# EAGLE design radio103 (EAGLE 9.6.2)

## Sheet 1 of 4: cpu
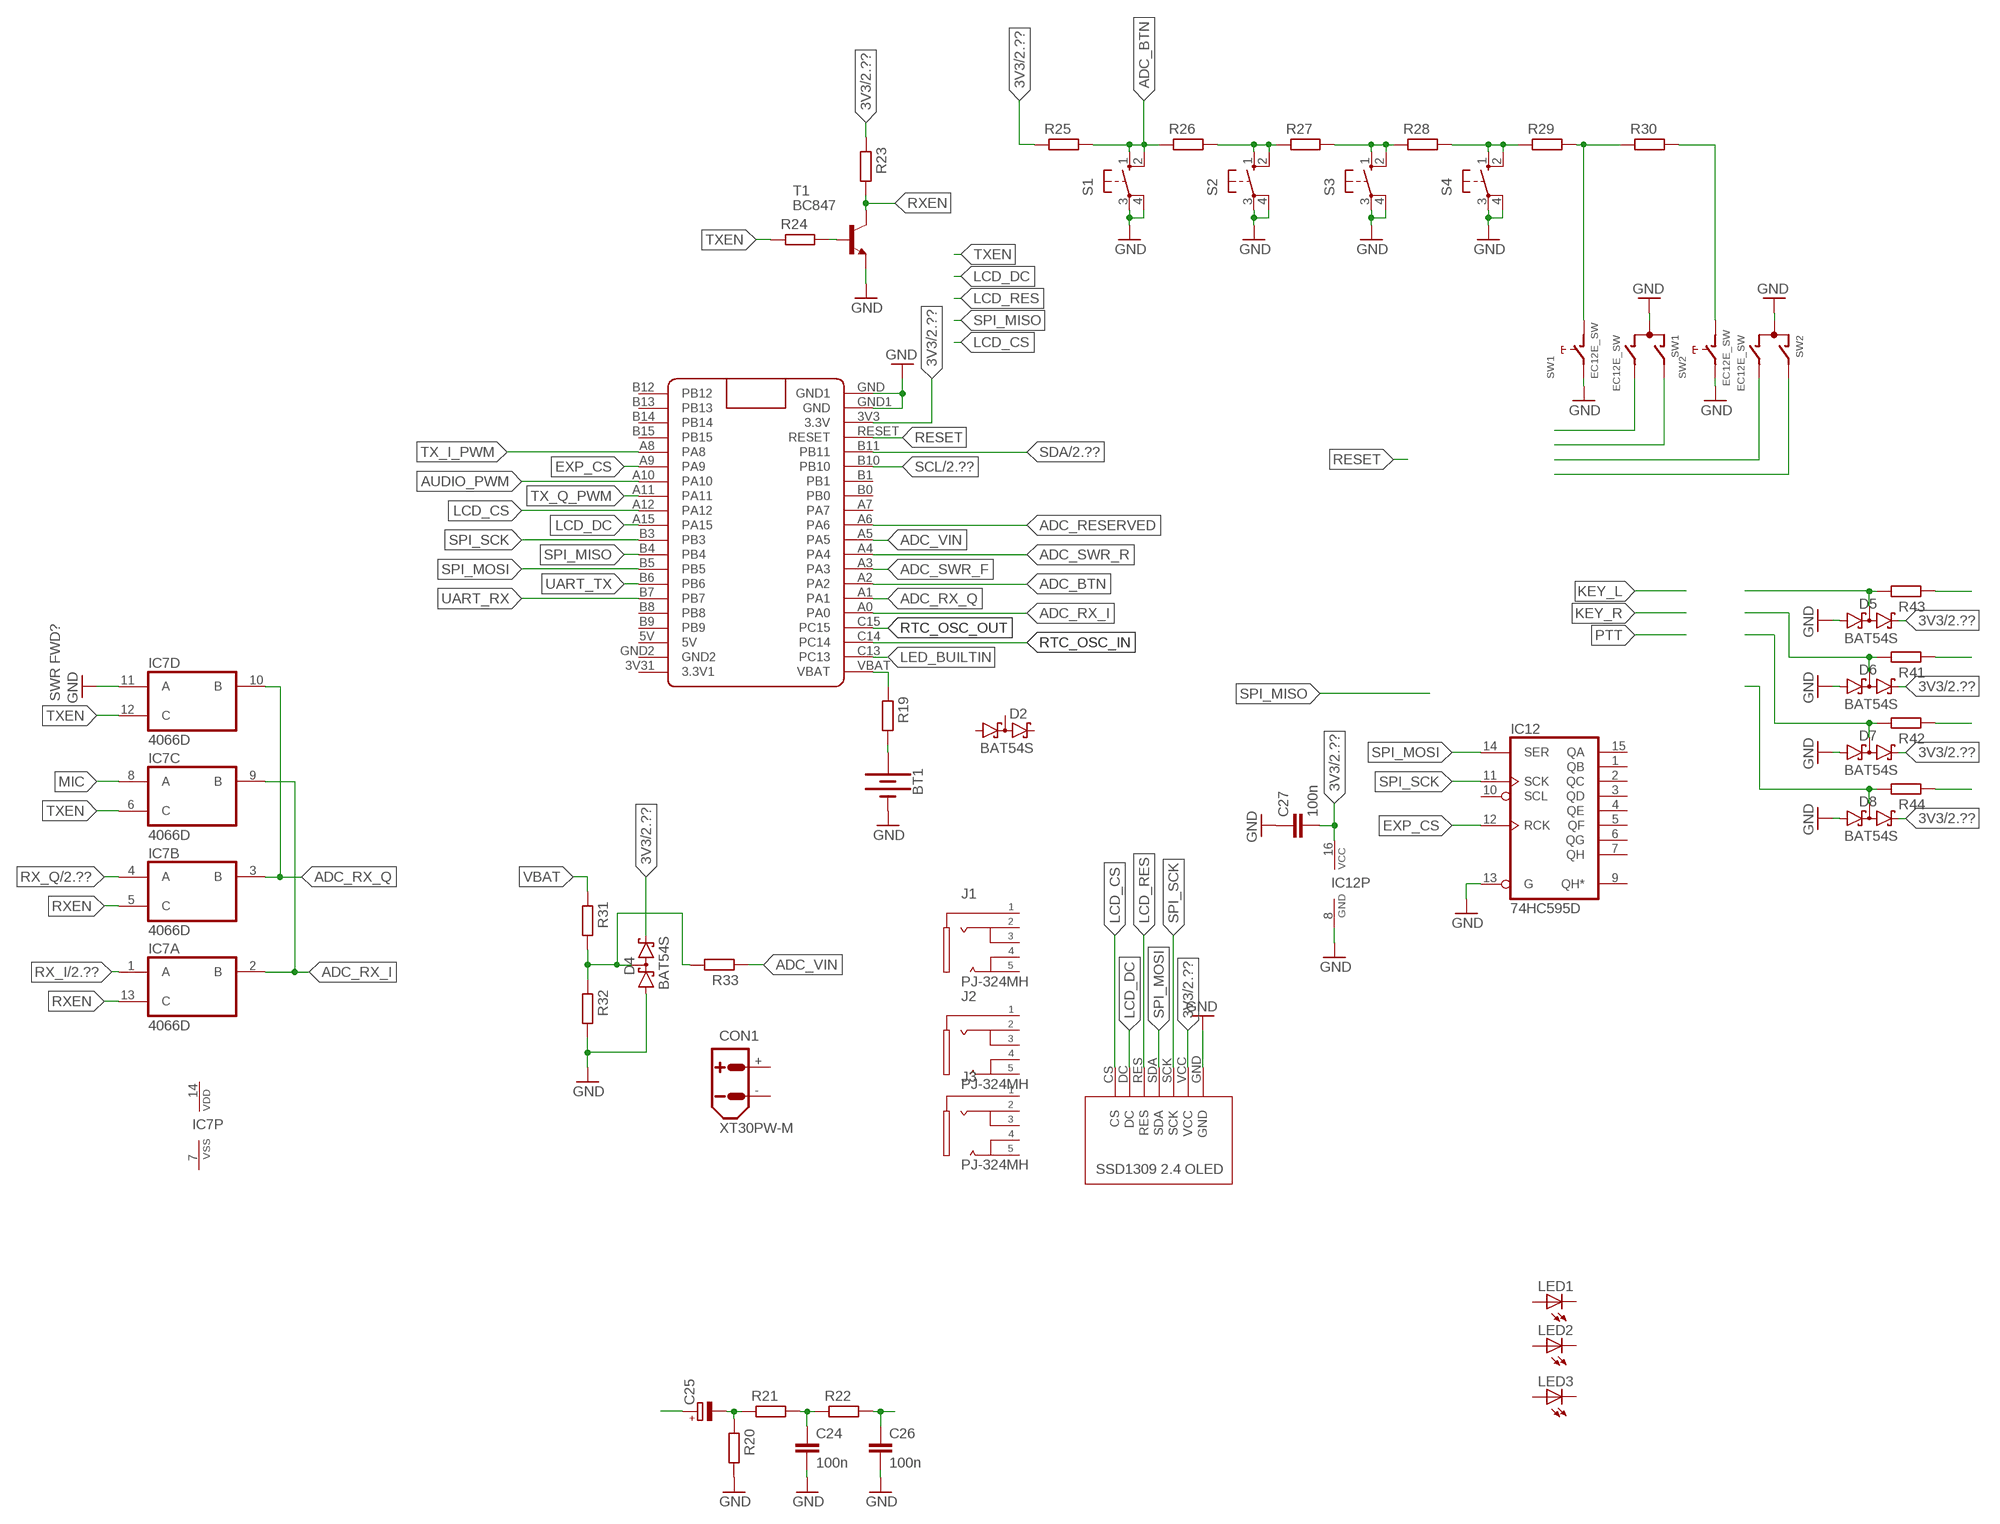
[diagram p0: schematic, sheet 1]

### Parts
BT1  BATTERY-12MM_SMD  [BATTCON_12MM]
C24  100n  C-EUC0805K  [C0805K]
C25  CPOL-EUE2,5-6E  [E2,5-6E]
C26  100n  C-EUC0805K  [C0805K]
C27  100n  C-EUC0805K  [C0805K]
CON1  XT30PW-M  [XT30PW-M]
D2  BAT54S  [SOT23]
D4  BAT54S  [SOT23]
D5  BAT54S  [SOT23]
D6  BAT54S  [SOT23]
D7  BAT54S  [SOT23]
D8  BAT54S  [SOT23]
IC7  4066D  [SO14]
IC12  74HC595D  [SO16]
J1  PJ-324MH  [PJ-324MH]
J2  PJ-324MH  [PJ-324MH]
J3  PJ-324MH  [PJ-324MH]
LED1  OSYG1608  [C1608]
LED2  OSYG1608  [C1608]
LED3  OSYG1608  [C1608]
R19  R-EU_R0805  [R0805]
R20  R-EU_R0805  [R0805]
R21  R-EU_R0805  [R0805]
R22  R-EU_R0805  [R0805]
R23  R-EU_R0805  [R0805]
R24  R-EU_R0805  [R0805]
R25  R-EU_R0805  [R0805]
R26  R-EU_R0805  [R0805]
R27  R-EU_R0805  [R0805]
R28  R-EU_R0805  [R0805]
R29  R-EU_R0805  [R0805]
R30  R-EU_R0805  [R0805]
R31  R-EU_R0805  [R0805]
R32  R-EU_R0805  [R0805]
R33  R-EU_R0805  [R0805]
R41  R-EU_R0805  [R0805]
R42  R-EU_R0805  [R0805]
R43  R-EU_R0805  [R0805]
R44  R-EU_R0805  [R0805]
S1  10-XX  [B3F-10XX]
S2  10-XX  [B3F-10XX]
S3  10-XX  [B3F-10XX]
S4  10-XX  [B3F-10XX]
SW1  EC12E_SW  [ALPS_EC12E_SW]
SW2  EC12E_SW  [ALPS_EC12E_SW]
T1  BC847  [SOT23]
U$1  BLUE_PILL  [BLUE_PILL]
U$4  SSD1309_2.4_OLED  [SSD1309_2.42_OLED]

### Nets
3V3: C27.2 D4.2(C2) D5.2(C2) D6.2(C2) D7.2(C2) D8.2(C2) IC12.16(VCC) R23.2 R25.2 U$1.3V3(3.3V) U$4.VCC ; also sheet 2,3
ADC_BTN: R25.1 R26.2 S1.1(S) S1.2(S1) U$1.A2
ADC_RESERVED: U$1.A6
ADC_RX_I: IC7.2(A:B) IC7.9(C:B) U$1.A0
ADC_RX_Q: IC7.3(B:B) IC7.10(D:B) U$1.A1
ADC_SWR_F: U$1.A3
ADC_SWR_R: U$1.A4
ADC_VIN: R33.2 U$1.A5
AUDIO_PWM: U$1.A10
EXP_CS: IC12.12(RCK) U$1.A9
GND: BT1.GND(-) C24.2 C26.2 C27.1 D4.1(A1) D5.1(A1) D6.1(A1) D7.1(A1) D8.1(A1) IC7.11(D:A) IC12.8(GND) IC12.13(G) R20.1 R32.1 S1.3(P) S1.4(P1) S2.3(P) S2.4(P1) S3.3(P) S3.4(P1) S4.3(P) S4.4(P1) SW1.C SW1.E SW2.C SW2.E T1.2(E) U$1.GND1(GND) U$1.GND(GND1) U$4.GND ; also sheet 2,3,4
LCD_CS: U$1.A12 U$4.CS
LCD_DC: U$1.A15 U$4.DC
LCD_RES: U$4.RES
LED_BUILTIN: U$1.C13
MIC: IC7.8(C:A)
N$16: SW1.B
N$32: C25.- R20.2 R21.2
N$33: C24.1 R21.1 R22.2
N$34: C26.1 R22.1
N$35: C25.+
N$36: BT1.PWR@1(+) R19.1
N$37: R19.2 U$1.VBAT
N$38: SW1.A
N$39: R24.1 T1.1(B)
N$40: SW2.B
N$41: SW2.A
N$42: R26.1 R27.2 S2.1(S) S2.2(S1)
N$43: D4.3(C1A2) R31.1 R32.2 R33.1
N$44: R27.1 R28.2 S3.1(S) S3.2(S1)
N$45: R28.1 R29.2 S4.1(S) S4.2(S1)
N$46: R29.1 R30.2 SW1.D
N$47: R30.1 SW2.D
N$55: D5.3(C1A2) R43.1
N$56: R43.2
N$57: D6.3(C1A2) R41.1
N$58: R41.2
N$59: D7.3(C1A2) R42.1
N$60: R42.2
N$61: D8.3(C1A2) R44.1
N$62: R44.2
RESET: U$1.RESET
RTC_OSC_IN: U$1.C14
RTC_OSC_OUT: U$1.C15
RX_I: IC7.1(A:A) ; also sheet 2
RX_Q: IC7.4(B:A) ; also sheet 2
RXEN: IC7.5(B:C) IC7.13(A:C) R23.1 T1.3(C)
SCL: U$1.B10 ; also sheet 2
SDA: U$1.B11 ; also sheet 2
SPI_MISO: U$1.B4
SPI_MOSI: IC12.14(SER) U$1.B5 U$4.SDA
SPI_SCK: IC12.11(SCK) U$1.B3 U$4.SCK
TX_I_PWM: U$1.A8
TX_Q_PWM: U$1.A11
TXEN: IC7.6(C:C) IC7.12(D:C) R24.2
UART_RX: U$1.B7
UART_TX: U$1.B6
VBAT: R31.2
Unconnected: D2.1(A1) D2.2(C2) D2.3(C1A2) IC12.1(QB) IC12.2(QC) IC12.3(QD) IC12.4(QE) IC12.5(QF) IC12.6(QG) IC12.7(QH) IC12.9(QH*) IC12.10(SCL) IC12.15(QA) J1.1 J1.2 J1.3 J1.4 J1.5 J2.1 J2.2 J2.3 J2.4 J2.5 J3.1 J3.2 J3.3 J3.4 J3.5 LED1.A LED1.C LED2.A LED2.C LED3.A LED3.C SW1.GND1(G) SW1.GND2(G) SW2.GND1(G) SW2.GND2(G) U$1.3V31(3.3V1) U$1.5V U$1.A7 U$1.B0 U$1.B1 U$1.B8 U$1.B9 U$1.B12 U$1.B13 U$1.B14 U$1.B15 U$1.GND2

### Notes on the sheet
- SWR FWD?

## Sheet 2 of 4: mixer
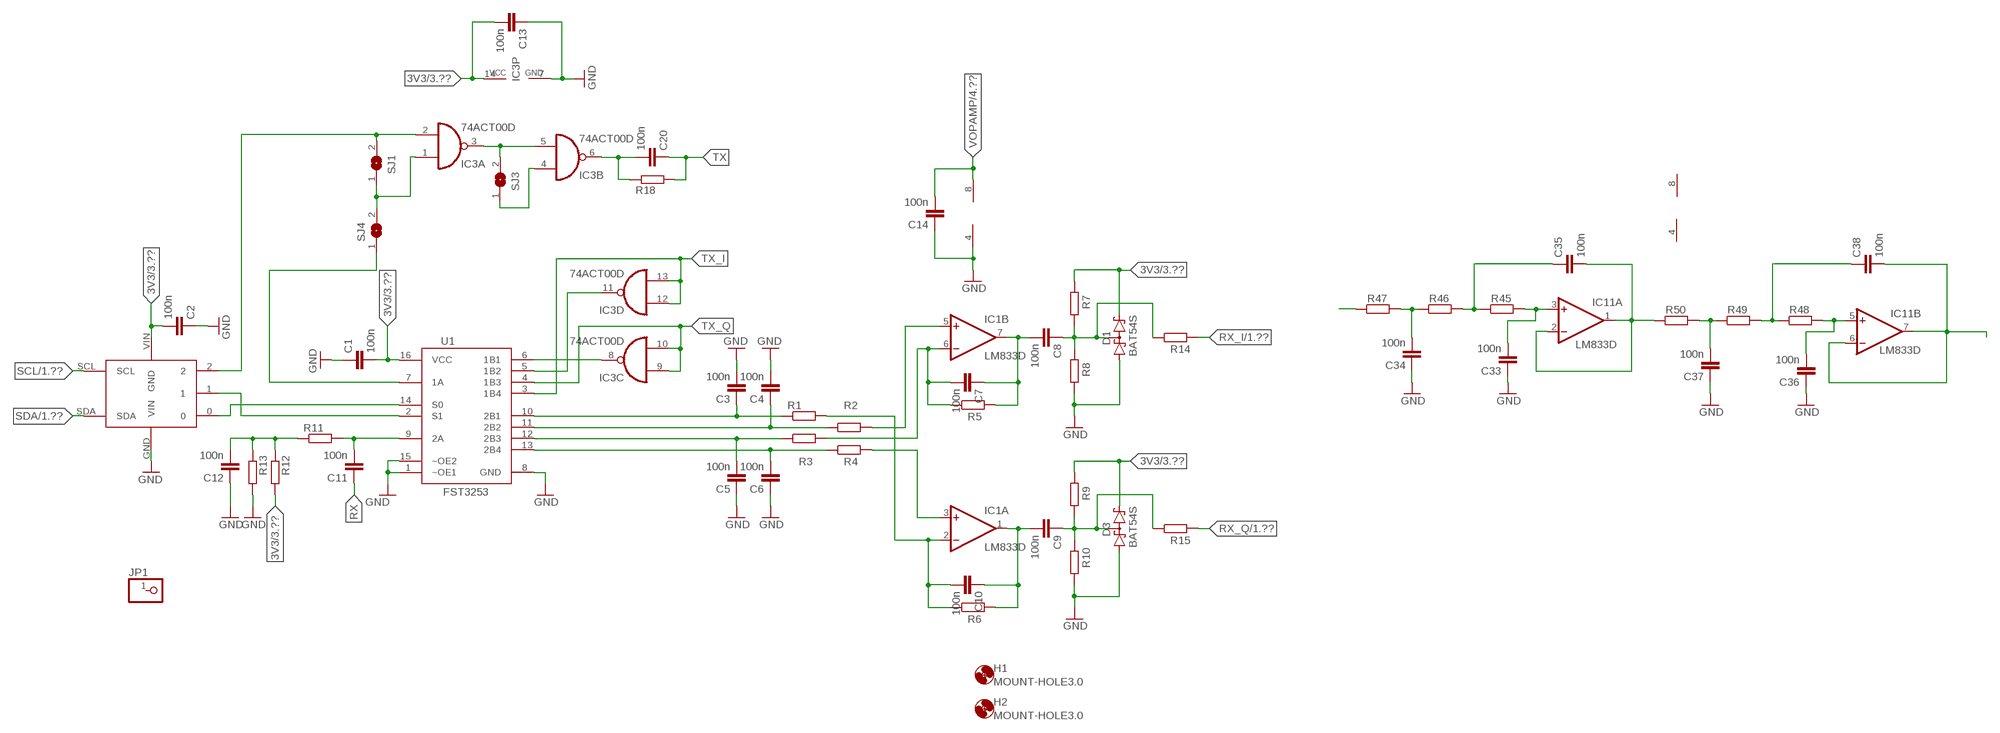
[diagram p1: schematic, sheet 2]

### Parts
C1  100n  C-EUC0805K  [C0805K]
C2  100n  C-EUC0805K  [C0805K]
C3  100n  C-EUC0805K  [C0805K]
C4  100n  C-EUC0805K  [C0805K]
C5  100n  C-EUC0805K  [C0805K]
C6  100n  C-EUC0805K  [C0805K]
C7  100n  C-EUC0805K  [C0805K]
C8  100n  C-EUC0805K  [C0805K]
C9  100n  C-EUC0805K  [C0805K]
C10  100n  C-EUC0805K  [C0805K]
C11  100n  C-EUC0805K  [C0805K]
C12  100n  C-EUC0805K  [C0805K]
C13  100n  C-EUC0805K  [C0805K]
C14  100n  C-EUC0805K  [C0805K]
C20  100n  C-EUC0805K  [C0805K]
C33  100n  C-EUC0805K  [C0805K]
C34  100n  C-EUC0805K  [C0805K]
C35  100n  C-EUC0805K  [C0805K]
C36  100n  C-EUC0805K  [C0805K]
C37  100n  C-EUC0805K  [C0805K]
C38  100n  C-EUC0805K  [C0805K]
D1  BAT54S  [SOT23]
D3  BAT54S  [SOT23]
H1  MOUNT-HOLE3.0  [3,0]
H2  MOUNT-HOLE3.0  [3,0]
IC1  LM833D  [SO08]
IC3  74ACT00D  [SO14]
IC11  LM833D  [SO08]
JP1  PINHD-1X1  [1X01]
R1  R-EU_R0805  [R0805]
R2  R-EU_R0805  [R0805]
R3  R-EU_R0805  [R0805]
R4  R-EU_R0805  [R0805]
R5  R-EU_R0805  [R0805]
R6  R-EU_R0805  [R0805]
R7  R-EU_R0805  [R0805]
R8  R-EU_R0805  [R0805]
R9  R-EU_R0805  [R0805]
R10  R-EU_R0805  [R0805]
R11  R-EU_R0805  [R0805]
R12  R-EU_R0805  [R0805]
R13  R-EU_R0805  [R0805]
R14  R-EU_R0805  [R0805]
R15  R-EU_R0805  [R0805]
R18  R-EU_R0805  [R0805]
R45  R-EU_R0805  [R0805]
R46  R-EU_R0805  [R0805]
R47  R-EU_R0805  [R0805]
R48  R-EU_R0805  [R0805]
R49  R-EU_R0805  [R0805]
R50  R-EU_R0805  [R0805]
SJ1  SJ  [SJ]
SJ3  SJ  [SJ]
SJ4  SJ  [SJ]
U1  FST3253  [TSSOP16L]
U$2  CJMCU-5351  [CJMCU-5351]

### Nets
3V3: C1.2 C2.2 C13.2 D1.2(C2) D3.2(C2) IC3.14(P:VCC) R7.2 R9.2 R12.2 U1.16(VCC) U$2.VIN(GND) ; also sheet 1,3
ADC_I1: C8.1 D1.3(C1A2) R7.1 R8.2 R14.1
ADC_Q1: C9.1 D3.3(C1A2) R9.1 R10.2 R15.1
GND: C1.1 C2.1 C3.2 C4.2 C5.1 C6.1 C12.1 C13.1 C14.1 C33.1 C34.1 C36.1 C37.1 D1.1(A1) D3.1(A1) IC1.4(P:V-) IC3.7(P:GND) R8.1 R10.1 R13.2 U1.1(~OE1) U1.8(GND) U1.15(~OE2) U$2.GND(VIN) ; also sheet 1,3,4
N$1: C3.1 R1.1 U1.10(2B1)
N$2: C4.1 R2.1 U1.11(2B2)
N$3: C5.2 R3.1 U1.12(2B3)
N$4: C6.2 R4.1 U1.13(2B4)
N$5: C10.2 IC1.2(A:-IN) R1.2 R6.1
N$6: IC1.5(B:+IN) R2.2
N$7: C7.2 IC1.6(B:-IN) R3.2 R5.1
N$8: IC1.3(A:+IN) R4.2
N$9: C9.2 C10.1 IC1.1(A:OUT) R6.2
N$10: C7.1 C8.2 IC1.7(B:OUT) R5.2
N$12: C11.2 R11.2 U1.9(2A)
N$13: U1.2(S1) U$2.1
N$14: C12.2 R11.1 R12.1 R13.1
N$15: U1.14(S0) U$2.0
N$17: IC3.8(C:O) U1.6(1B1)
N$18: IC3.11(D:O) U1.5(1B2)
N$26: IC3.2(A:I1) SJ1.2 U$2.2
N$27: IC3.1(A:I0) SJ1.1 SJ4.2
N$28: IC3.3(A:O) IC3.5(B:I1) SJ3.2
N$29: IC3.4(B:I0) SJ3.1
N$30: C20.2 IC3.6(B:O) R18.1
N$31: SJ4.1 U1.7(1A)
N$63: C33.2 IC11.3(A:+IN) R45.2
N$64: C35.1 R45.1 R46.2
N$65: C35.2 IC11.1(A:OUT) IC11.2(A:-IN) R50.1
N$66: C38.1 R48.1 R49.2
N$67: C34.2 R46.1 R47.2
N$68: R47.1
N$69: C37.2 R49.1 R50.2
N$71: C36.2 IC11.5(B:+IN) R48.2
N$73: C38.2 IC11.6(B:-IN) IC11.7(B:OUT)
RX: C11.1
RX_I: R14.2 ; also sheet 1
RX_Q: R15.2 ; also sheet 1
SCL: U$2.SCL ; also sheet 1
SDA: U$2.SDA ; also sheet 1
TX: C20.1 R18.2
TX_I: IC3.12(D:I0) IC3.13(D:I1) U1.3(1B4)
TX_Q: IC3.9(C:I0) IC3.10(C:I1) U1.4(1B3)
VOPAMP: C14.2 IC1.8(P:V+) ; also sheet 4
Unconnected: JP1.1

## Sheet 3 of 4: power
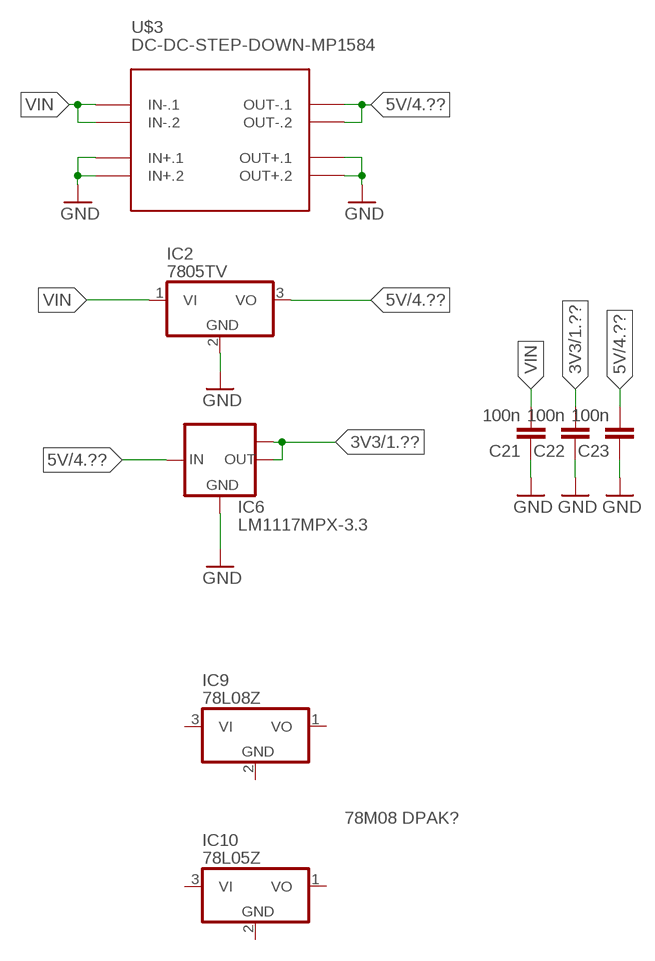
[diagram p2: schematic, sheet 3]

### Parts
C21  100n  C-EUC0805K  [C0805K]
C22  100n  C-EUC0805K  [C0805K]
C23  100n  C-EUC0805K  [C0805K]
IC2  7805TV  [TO220V]
IC6  LM1117MPX-3.3  [SOT223]
IC9  78L08Z  [TO92]
IC10  78L05Z  [TO92]
U$3  DC-DC-STEP-DOWN-MP1584  [DC-DC-STEP-DOWN-MP1584]

### Nets
3V3: C22.2 IC6.2(OUT) IC6.TAB(OUT1) ; also sheet 1,2
5V: C23.2 IC2.3(VO) IC6.3(IN) U$3.OUT-.1 U$3.OUT-.2 ; also sheet 4
GND: C21.1 C22.1 C23.1 IC2.2(GND) IC6.1(GND) U$3.IN+.1 U$3.IN+.2 U$3.OUT+.1 U$3.OUT+.2 ; also sheet 1,2,4
VIN: C21.2 IC2.1(VI) U$3.IN-.1 U$3.IN-.2
Unconnected: IC9.1(VO) IC9.2(GND) IC9.3(VI) IC10.1(VO) IC10.2(GND) IC10.3(VI)

### Notes on the sheet
- 78M08 DPAK?

## Sheet 4 of 4: audio
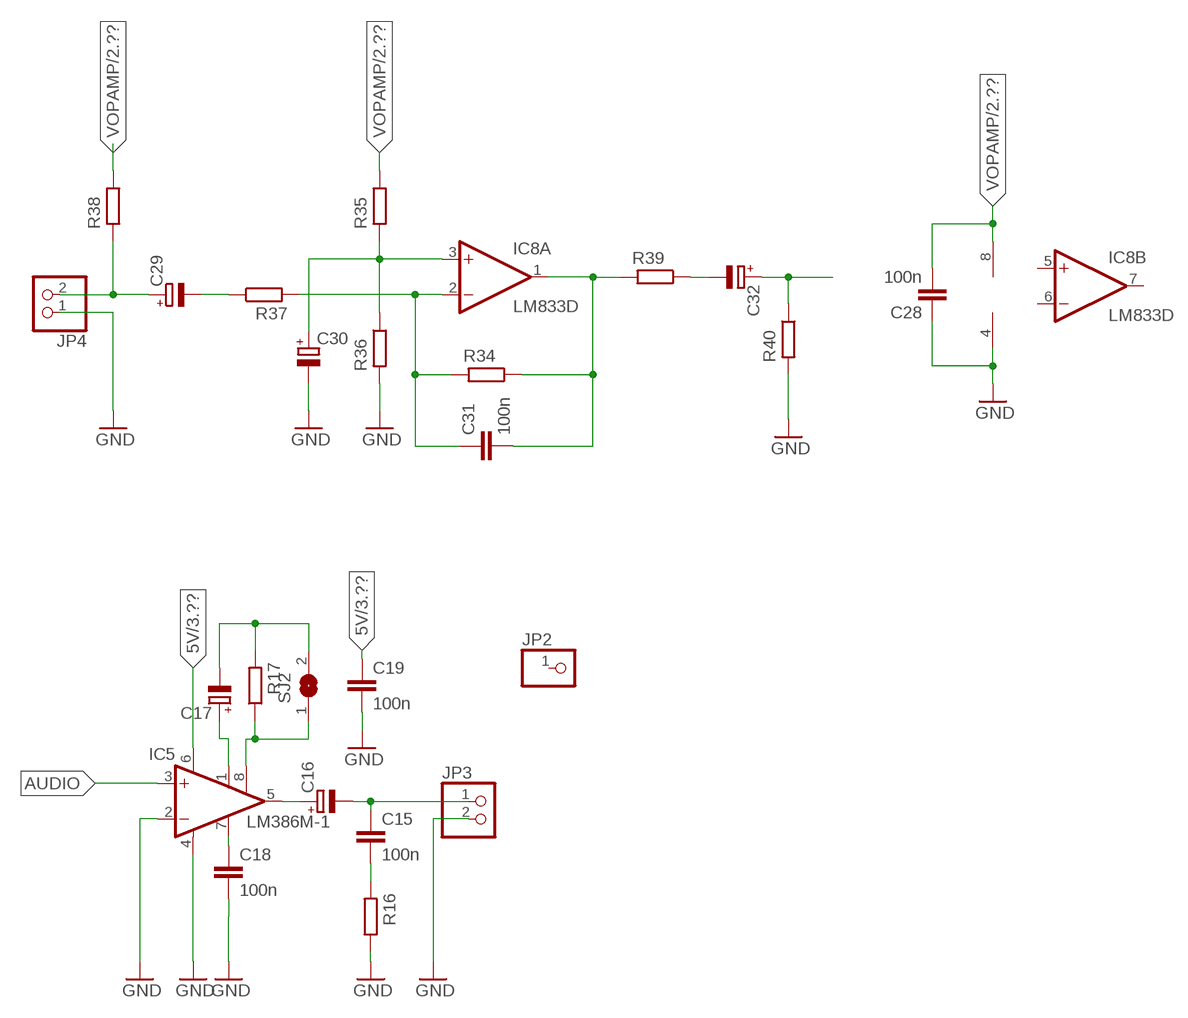
[diagram p3: schematic, sheet 4]

### Parts
C15  100n  C-EUC0805K  [C0805K]
C16  CPOL-EUE2,5-6E  [E2,5-6E]
C17  CPOL-EUE2,5-6E  [E2,5-6E]
C18  100n  C-EUC0805K  [C0805K]
C19  100n  C-EUC0805K  [C0805K]
C28  100n  C-EUC0805K  [C0805K]
C29  CPOL-EUE2,5-6E  [E2,5-6E]
C30  CPOL-EUE2,5-6E  [E2,5-6E]
C31  100n  C-EUC0805K  [C0805K]
C32  CPOL-EUE2,5-6E  [E2,5-6E]
IC5  LM386M-1  [SO08]
IC8  LM833D  [SO08]
JP2  PINHD-1X1  [1X01]
JP3  PINHD-1X2  [1X02]
JP4  PINHD-1X2  [1X02]
R16  R-EU_R0805  [R0805]
R17  R-EU_R0805  [R0805]
R34  R-EU_R0805  [R0805]
R35  R-EU_R0805  [R0805]
R36  R-EU_R0805  [R0805]
R37  R-EU_R0805  [R0805]
R38  R-EU_R0805  [R0805]
R39  R-EU_R0805  [R0805]
R40  R-EU_R0805  [R0805]
SJ2  SJ  [SJ]

### Nets
5V: C19.1 IC5.6(VS) ; also sheet 3
AUDIO: IC5.3(+IN)
GND: C18.2 C19.2 C28.1 C30.- IC5.2(-IN) IC5.4(GND) IC8.4(P:V-) JP3.2 JP4.1 R16.1 R36.2 R40.2 ; also sheet 1,2,3
N$19: C17.+ IC5.1(GAIN)
N$20: IC5.8(GAIN) R17.1 SJ2.1
N$21: C17.- R17.2 SJ2.2
N$22: C18.1 IC5.7(BYPASS)
N$23: C16.+ IC5.5(OUT)
N$24: C15.1 C16.- JP3.1
N$25: C15.2 R16.2
N$48: C30.+ IC8.3(A:+IN) R35.2 R36.1
N$49: C31.1 IC8.2(A:-IN) R34.2 R37.2
N$50: C31.2 IC8.1(A:OUT) R34.1 R39.2
N$51: C29.- R37.1
N$52: C29.+ JP4.2 R38.2
N$53: C32.- R39.1
N$54: C32.+ R40.1
VOPAMP: C28.2 IC8.8(P:V+) R35.1 R38.1 ; also sheet 2
Unconnected: IC8.5(B:+IN) IC8.6(B:-IN) IC8.7(B:OUT) JP2.1

## Power pins joined to a net without a drawn wire
+: CON1.+
-: CON1.-
V+: IC11.8(P:V+)
V-: IC11.4(P:V-)
VDD: IC7.14(P:VDD)
VSS: IC7.7(P:VSS)

## Library data of the parts
BT1 = SparkFun-Batteries:BATTERY: Battery - Single Cell A variety of battery chemistries, sizes, and footprints. Device List: 20MM_PTH - Coin Cell Battery Holder - 20mm (PTH) <https://www.sparkfun.com/products/783> 20MM_PTH_KIT- Coin Cell battery Holder - 20 mm (PTH) <http://www.sparkfun.com/products/783>kit version with special mask 6.8MM_PTH - Coin Cell Battery Holder - 6.8MM(SMD) <https://www.digikey.com/product-detail/en/seiko-instruments/MS621FE-FL11E/728-1057-ND/1889208?WT.srch=1&gclid=CNOQ5a6LzdQCFZS2wAodXCkE0g> 12MM_SMD - Coin Cell Battery Holder - 12mm (SMD) <https://www.sparkfun.com/products/10592> 12MM_PTH - Coin Cell Battery Holder - 12mm (PTH) <https://www.sparkfun.com/products/7948> 20MM_SMD - 20mm Coin Cell Battery Holder (SMD) (2 legs) Used on the Big Time Watch Kit <https://www.sparkfun.com/products/11734> 20MM_SMD_4LEGS - Coin Cell Battery Holder - 20mm (SMD) <https://www.sparkfun.com/products/11892> 20MM_SMD_4LEGS_OVERPASTE - Coin Cell Battery Holder - 20mm (SMD) <https://www.sparkfun.com/products/11892> (Over-paste on the legs) 24.5MM_PTH - Coin Cell Battery Holder - 24.5mm (PTH) <https://www.sparkfun.com/products/8863> 9V - 9V Battery Holder - PC Mount Used on the SparkFun SparkPunk Sound Kit <https://www.sparkfun.com/products/11177> and SparkFun SparkPunk Sequencer Kit <https://www.sparkfun.com/products/12707> 18650 - Battery Holder - 18650 (PTH) <https://www.sparkfun.com/products/13113> AA - Battery Holder - 1xAA (PTH) <https://www.sparkfun.com/products/7949> AAA - Battery Holder - 1xAAA (PTH) <https://www.sparkfun.com/products/12718> AA_KIT - Battery Holder - 1xAA (PTH) <https://www.sparkfun.com/products/7949> Special kit package - pads only have exposed copper on one side of the board. AAA_KIT - Battery Holder - 1xAAA (PTH) <https://www.sparkfun.com/products/12718> Special kit package - pads only have exposed copper on one side of the board.; PROD_ID: BATT-08044; SF_SKU: PRT-10592
C1-C15 C18-C24 C26-C28 C31 C33-C38 = rcl:C-EU: CAPACITOR, European symbol; SPICEPREFIX: C
C16 C17 C25 C29 C30 C32 = rcl:CPOL-EU: POLARIZED CAPACITOR, European symbol; SPICEPREFIX: C
CON1 = amass:XT30: AMASS XT30 connector Store in Japan AMASS XT30 connector <https://szc.jp/ams-xt30>
D1-D8 = diode:BAT54S: Schottky Diodes Pin connection corrected 2011-05-04 Source: Fairchild .. BAT54.pdf
H1 H2 = holes:MOUNT-HOLE: MOUNTING HOLE with drill center marker
IC1 IC8 IC11 = linear:LM833: OP AMP
IC2 IC9 IC10 = linear:78*: Positive VOLTAGE REGULATOR Source: http://cache.national.com/ds/LM/LM78L05.pdf http://www.fairchildsemi.com/ds/LM/LM7805.pdf
IC3 = 74xx-eu:74*00: Quad 2-input NAND gate
IC5 = linear:LM386?-*: Low Voltage Audio Power Amplifier Source: http://cache.national.com/ds/LM/LM386.pdf
IC6 = lm1117:LM1117MPX-*
IC7 = 40xx:4066: Quad bilateral ANALOG SWITCH
IC12 = 74xx-eu:74*595: 8-bit SHIFT REGISTER, output latch
J1-J3 = ub0baa:PJ-324M
JP1 JP2 = pinhead:PINHD-1X1: PIN HEADER
JP3 JP4 = pinhead:PINHD-1X2: PIN HEADER
LED1-LED3 = led-smd:OSYG1608
R1-R50 = rcl:R-EU_: RESISTOR, European symbol; SPICEPREFIX: R
S1-S4 = switch-omron:10-XX: OMRON SWITCH; MPN: B3F-1000; OC_FARNELL: 176432; OC_NEWARK: 36M3542
SJ1-SJ4 = jumper:SJ: SMD solder JUMPER
SW1 SW2 = switch-alps:EC12E_SW: ALPS rotary Encoder EC12E series with switch; MPN: EC12E2424407; OC_FARNELL: 1520813; OC_NEWARK: 74M1068
T1 = transistor:BC847: NPN TRANSISTOR
U1 = ub0baa:FST3253
U$1 = BluePill:BLUE_PILL
U$2 = ub0baa:CJMCU-5351
U$3 = diy-modules:DC-DC-STEP-DOWN-MP1584: DC/DC Step-Down Regulator based on MP1584 chip MP1584 datasheet available here: http://www.haoyuelectronics.com/Attachment/MP1584/MP1584.pdf Click here to find device on ebay.com <http://www.ebay.com/sch/mp1584+module>
U$4 = ub0baa:SSD1309_2.4_OLED

## Net classes
0 default: clearance 0.205 mm

## Board
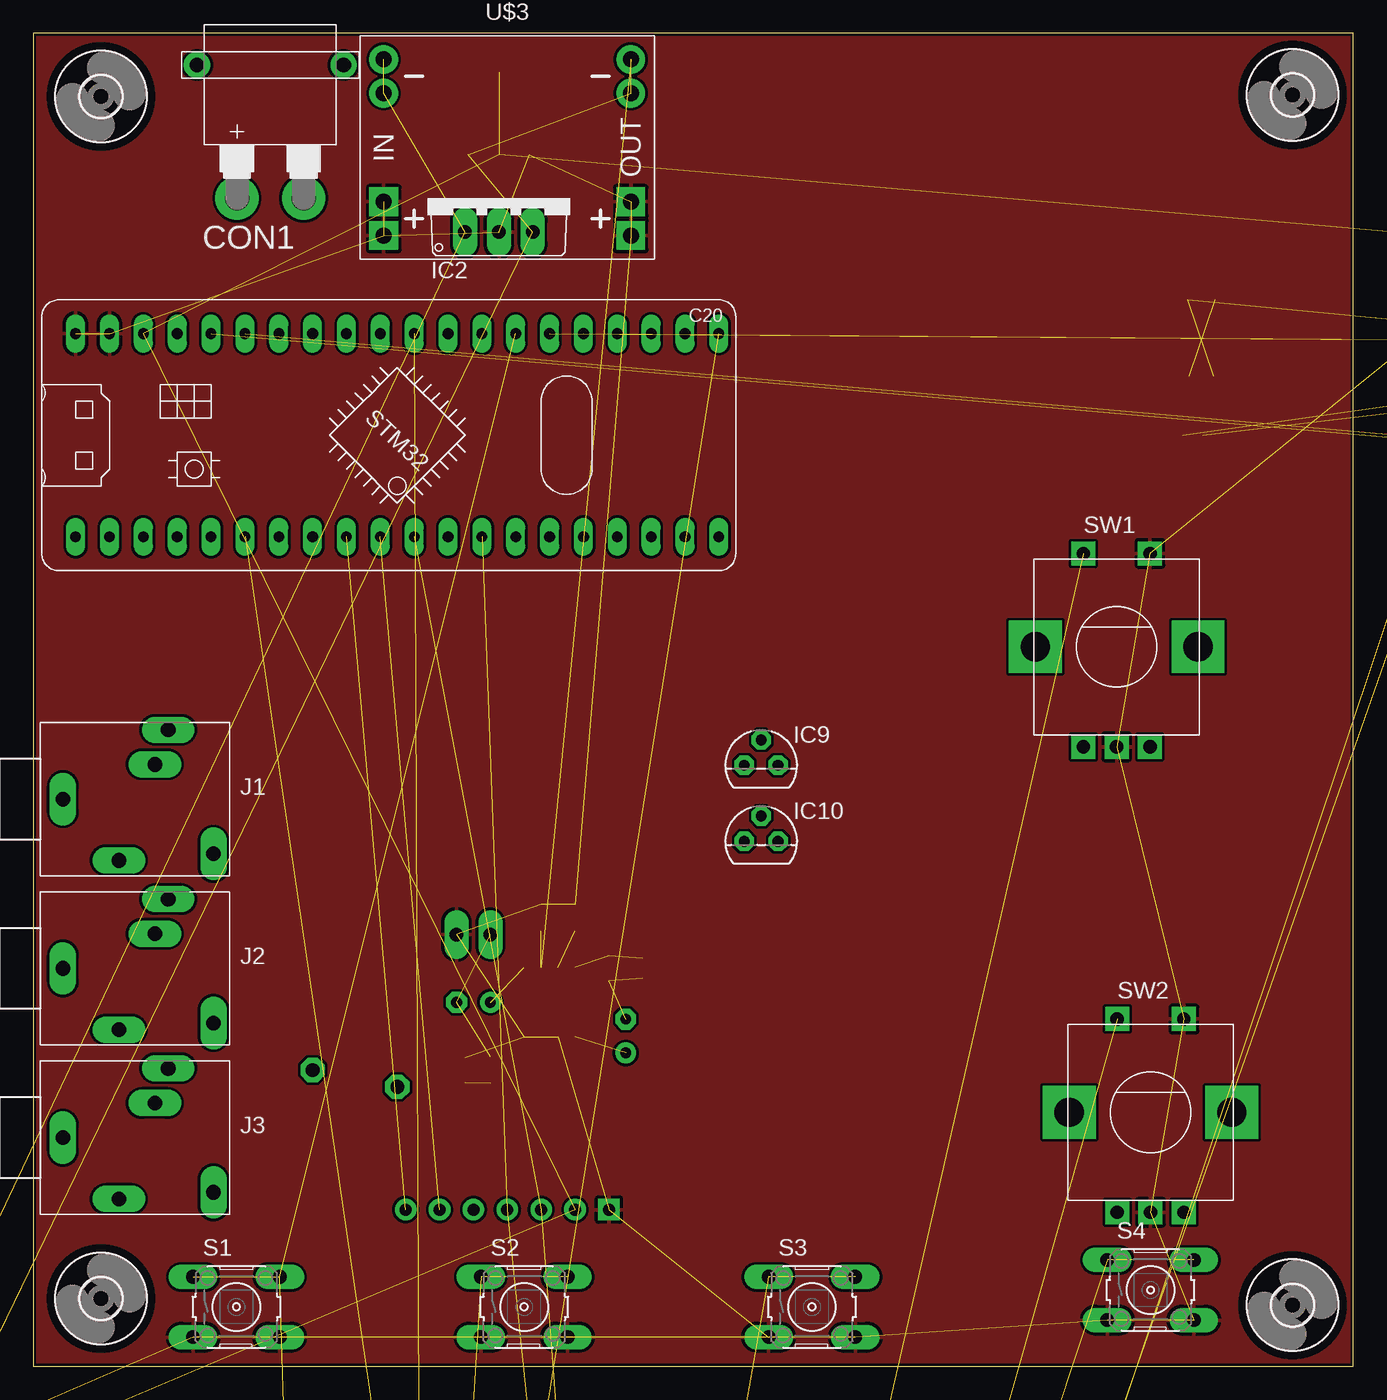
[diagram p4: board, top side]
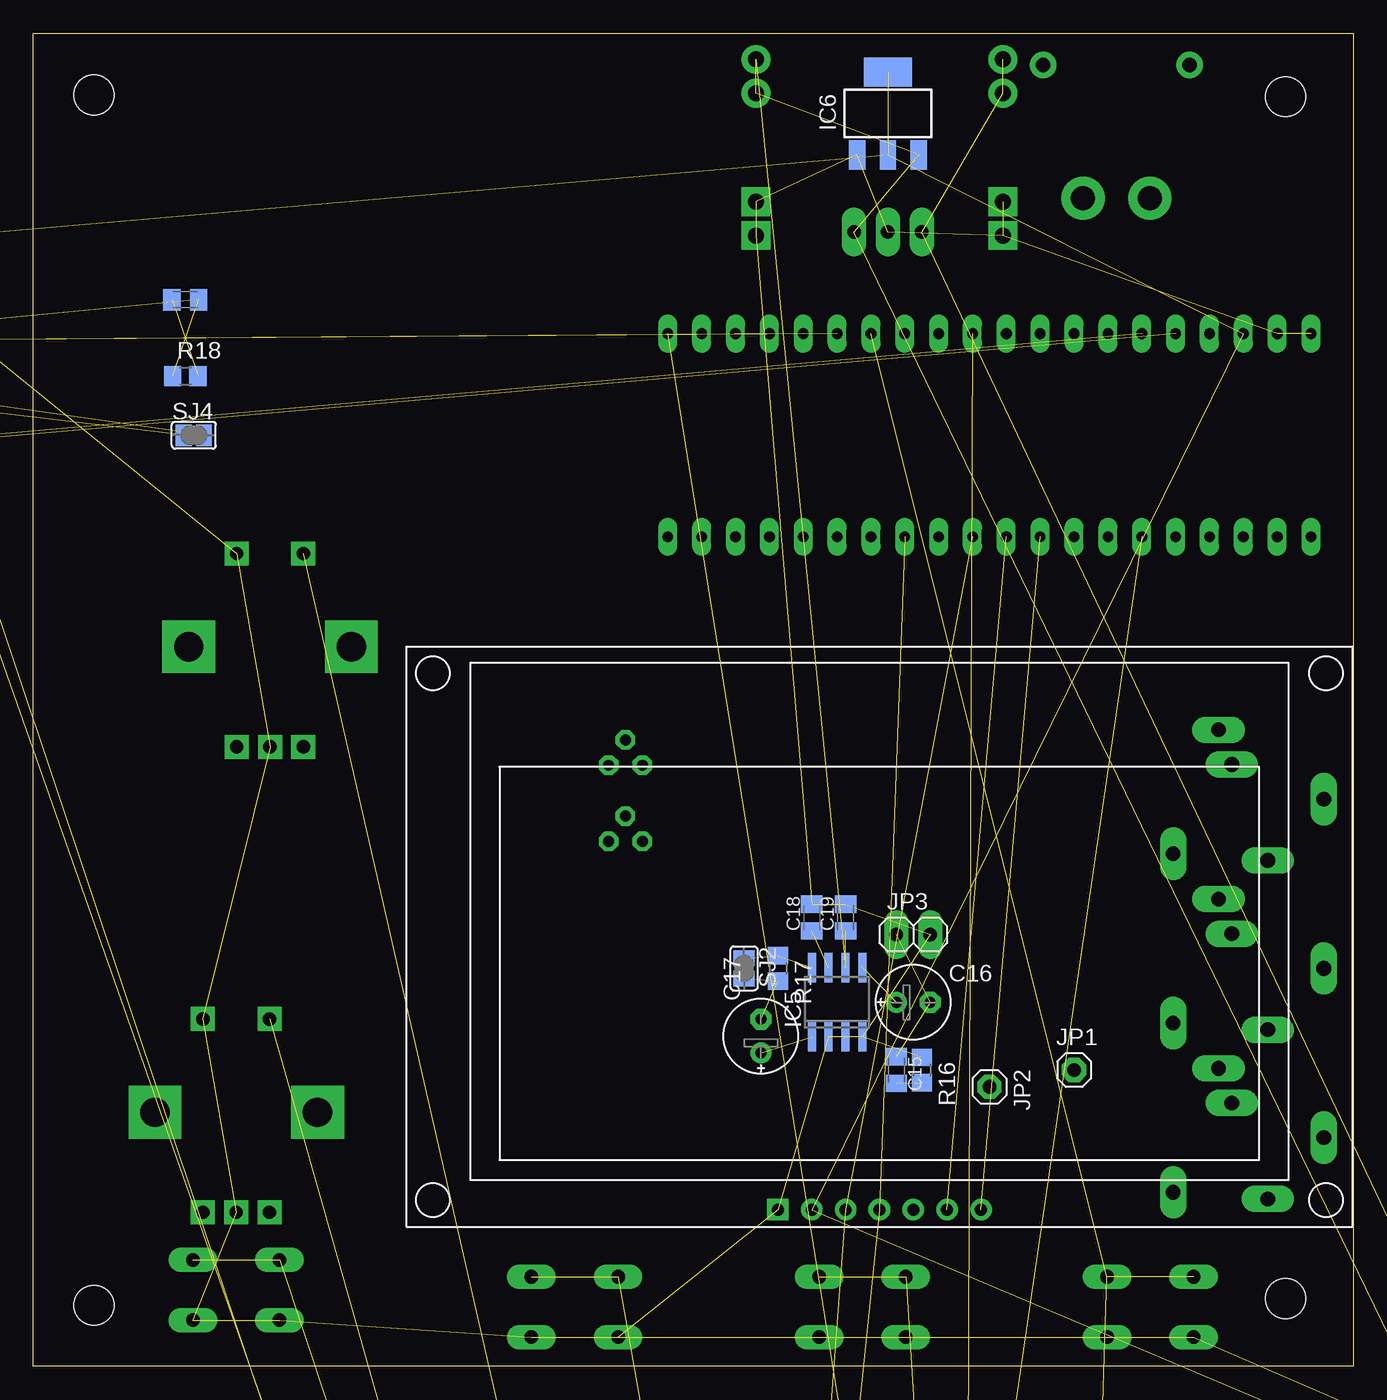
[diagram p5: board, bottom side, seen from below]

Size 99.04 x 100 mm. Coordinates in mm from the lower left corner, seen from the top.
Outline: 0,0 99.04,0 99.04,100 0,100 0,0
Copper layers (1*16): Top 0.035mm / dielectric 1.6mm / Bottom 0.035mm
Design rules "jlcpcb-2layers": minimum track width 5mil, minimum drill 0.3mm, track to track 5mil, track to pad 5mil, pad to pad 5mil, via to via 5mil, smd to smd 5mil, copper to edge 0.2mm, drill to drill 6mil, minimum pad ring 10mil, minimum via ring 3mil, stop-mask expansion 4mil, vias tented up to drill 0mil, thermal gap 10mil

### Footprints (pad centres in the part's own frame; a part is rotated, then mirrored left to right if it is on the bottom)
BATTCON_12MM = smd 8 x 8: GND 0,0 | smd 3.175 x 3.175: PWR@1 -7.874,0; PWR@2 7.874,0
C0805K = smd 1.3 x 1.6: 1 -1,0; 2 1,0
E2,5-6E = drill 0.813 pad 1.575: + -1.27,0 | drill 0.813 pad 1.575 octagon: - 1.27,0
XT30PW-M = drill 1.8: + -2.5,0; - 2.5,0 | drill 1.1: P$3 -5.5,10; P$4 5.5,10
SOT23 = smd 1 x 1.4: 1 -0.95,-1.1; 2 0.95,-1.1; 3 0,1.1
3,0 = hole 3: 0,0
SO08 = smd 0.6 x 2.2: 1 -1.905,-2.6; 2 -0.635,-2.6; 3 0.635,-2.6; 4 1.905,-2.6; 5 1.905,2.6; 6 0.635,2.6; 7 -0.635,2.6; 8 -1.905,2.6
TO220V = drill 1.016 long: 1 -2.54,-2.54; 2 0,-2.54; 3 2.54,-2.54
SO14 = smd 0.66 x 2.032: 1 -3.81,-3.073; 2 -2.54,-3.073; 3 -1.27,-3.073; 4 0,-3.073; 5 1.27,-3.073; 6 2.54,-3.073; 7 3.81,-3.073; 8 3.81,3.073; 9 2.54,3.073; 10 1.27,3.073; 11 0,3.073; 12 -1.27,3.073; 13 -2.54,3.073; 14 -3.81,3.073
SOT223 = smd 1.219 x 2.235: 1 -2.311,-3.099; 2 0,-3.099; 3 2.311,-3.099 | smd 3.6 x 2.2: TAB 0,3.099
TO92 = drill 0.813 octagon: 1 -1.27,0; 2 0,1.905; 3 1.27,0
SO16 = smd 0.66 x 2.032: 1 -4.445,-3.073; 2 -3.175,-3.073; 3 -1.905,-3.073; 4 -0.635,-3.073; 5 0.635,-3.073; 6 1.905,-3.073; 7 3.175,-3.073; 8 4.445,-3.073; 9 4.445,3.073; 10 3.175,3.073; 11 1.905,3.073; 12 0.635,3.073; 13 -0.635,3.073; 14 -1.905,3.073; 15 -3.175,3.073; 16 -4.445,3.073
PJ-324MH = drill 1.1 long: 1 -5.4,0; 2 2.5,5.2; 3 1.5,2.6; 4 5.9,-4.1; 5 -1.2,-4.6
1X01 = drill 1.016 octagon: 1 0,0
1X02 = drill 1.016 long: 1 -1.27,0; 2 1.27,0
C1608 = smd 1.1 x 1: A 0.85,0; C -0.85,0
R0805 = smd 1.3 x 1.5: 1 -0.95,0; 2 0.95,0
B3F-10XX = drill 1.016 long: 1 -3.251,2.261; 2 3.251,2.261; 3 -3.251,-2.261; 4 3.251,-2.261
SJ = smd 1.168 x 1.6: 1 -0.762,0; 2 0.762,0
ALPS_EC12E_SW = drill 1 square: A -2.5,-7.5; B 2.5,-7.5; C 0,-7.5; D -2.5,7; E 2.5,7 | drill 2.2 square: GND1 -6.1,0; GND2 6.1,0
TSSOP16L = smd 0.42 x 1.78: 1 -2.275,-2.97; 2 -1.625,-2.97; 3 -0.975,-2.97; 4 -0.325,-2.97; 5 0.325,-2.97; 6 0.975,-2.97; 7 1.625,-2.97; 8 2.275,-2.97; 9 2.275,2.97; 10 1.625,2.97; 11 0.975,2.97; 12 0.325,2.97; 13 -0.325,2.97; 14 -0.975,2.97; 15 -1.625,2.97; 16 -2.275,2.97
BLUE_PILL = drill 0.8 long: 3V3 7.62,10.16; 3V31 -7.62,-33.02; 5V -7.62,-27.94; A0 7.62,-22.86; A1 7.62,-20.32; A2 7.62,-17.78; A3 7.62,-15.24; A4 7.62,-12.7; A5 7.62,-10.16; A6 7.62,-7.62; A7 7.62,-5.08; A8 -7.62,5.08; A9 -7.62,2.54; A10 -7.62,0; A11 -7.62,-2.54; A12 -7.62,-5.08; A15 -7.62,-7.62; B0 7.62,-2.54; B1 7.62,0; B3 -7.62,-10.16; B4 -7.62,-12.7; B5 -7.62,-15.24; B6 -7.62,-17.78; B7 -7.62,-20.32; B8 -7.62,-22.86; B9 -7.62,-25.4; B10 7.62,2.54; B11 7.62,5.08; B12 -7.62,15.24; B13 -7.62,12.7; B14 -7.62,10.16; B15 -7.62,7.62; C13 7.62,-30.48; C14 7.62,-27.94; C15 7.62,-25.4; GND 7.62,15.24; GND1 7.62,12.7; GND2 -7.62,-30.48; RESET 7.62,7.62; VBAT 7.62,-33.02
CJMCU-5351 = drill 0.8: 0 -7.62,0; 1 -5.08,0; 2 -2.54,0; SCL 0,0; SDA 2.54,0; VIN 5.08,0 | drill 0.8 square: GND 7.62,0
DC-DC-STEP-DOWN-MP1584 = drill 1.2 pad 2 square: IN+.1 -9.271,-4.064; IN+.2 -9.271,-6.604; OUT+.1 9.271,-4.064; OUT+.2 9.271,-6.604 | drill 1.2 pad 2: IN-.1 -9.271,6.604; IN-.2 -9.271,4.064; OUT-.1 9.271,6.604; OUT-.2 9.271,4.064
SSD1309_2.42_OLED = drill 0.9: CS -7.62,42.226; DC -5.08,42.226; RES -2.54,42.226; SCK 2.54,42.226; SDA 0,42.226; VCC 5.08,42.226 | drill 0.9 square: GND 7.62,42.226

### Placement (x,y rotation side)
BT1  137.79,15.88 0 bottom  (outside the outline)
C1  136.53,69.85 180 bottom  (outside the outline)
C2  125.09,64.77 180 bottom  (outside the outline)
C3  141.6,80.01 90 bottom  (outside the outline)
C4  139.06,80.01 90 bottom  (outside the outline)
C5  136.53,80.01 270 bottom  (outside the outline)
C6  133.99,80.01 270 bottom  (outside the outline)
C7  142.88,83.82 0 bottom  (outside the outline)
C8  142.88,87.63 0 bottom  (outside the outline)
C9  142.88,90.17 0 bottom  (outside the outline)
C10  139.06,90.17 0 bottom  (outside the outline)
C11  147.96,74.93 0 bottom  (outside the outline)
C12  147.96,64.77 180 bottom  (outside the outline)
C13  136.53,63.5 0 bottom  (outside the outline)
C14  136.53,58.42 0 bottom  (outside the outline)
C15  34.29,22.23 270 bottom
C16  33.02,27.3 0 bottom
C17  44.45,24.77 90 bottom
C18  40.64,33.66 90 bottom
C19  38.1,33.66 90 bottom
C20  87.63,80.01 0 bottom
C21  -10.16,-6.99 0 bottom  (outside the outline)
C22  -10.16,-10.16 0 bottom  (outside the outline)
C23  -10.16,-15.24 0 bottom  (outside the outline)
C24  12.7,-165.1 0 bottom  (outside the outline)
C25  11.43,-175.26 0 bottom  (outside the outline)
C26  12.7,-189.87 0 bottom  (outside the outline)
C27  13.34,-215.9 0 bottom  (outside the outline)
C28  41.27,-160.66 0 bottom  (outside the outline)
C29  40.01,-184.15 0 bottom  (outside the outline)
C30  40.01,-201.29 0 bottom  (outside the outline)
C31  41.27,-207.01 0 bottom  (outside the outline)
C32  40.01,-217.17 0 bottom  (outside the outline)
C33  62.87,-178.44 0 bottom  (outside the outline)
C34  62.87,-183.51 0 bottom  (outside the outline)
C35  62.87,-188.59 0 bottom  (outside the outline)
C36  62.87,-193.68 0 bottom  (outside the outline)
C37  58.42,-193.68 0 bottom  (outside the outline)
C38  62.87,-212.09 0 bottom  (outside the outline)
CON1  17.78,87.63 0 top
D1  151.76,86.36 0 bottom  (outside the outline)
D2  151.76,66.04 0 bottom  (outside the outline)
D3  151.76,91.44 0 bottom  (outside the outline)
D4  31.75,-150.5 0 bottom  (outside the outline)
D5  52.7,-113.67 0 bottom  (outside the outline)
D6  52.7,-130.18 0 bottom  (outside the outline)
D7  52.7,-142.24 0 bottom  (outside the outline)
D8  52.7,-154.31 0 bottom  (outside the outline)
H1  94.49,4.57 0 top
H2  -13.97,77.47 0 top  (outside the outline)
H3  MOUNT-HOLE3.0  [3,0]  94.49,95.38 0 top
H4  MOUNT-HOLE3.0  [3,0]  5.08,95.25 0 top
H5  MOUNT-HOLE3.0  [3,0]  5.08,5.08 0 top
IC1  131.44,87.63 0 bottom  (outside the outline)
IC2  34.92,87.63 0 top
IC3  121.28,80.01 0 bottom  (outside the outline)
IC5  38.73,27.3 0 bottom
IC6  34.92,93.98 0 bottom
IC7  111.12,80.01 0 bottom  (outside the outline)
IC8  38.73,-153.67 0 bottom  (outside the outline)
IC9  54.61,45.09 0 top
IC10  54.61,39.37 0 top
IC11  60.33,-158.12 0 bottom  (outside the outline)
IC12  57.15,-219.71 0 bottom  (outside the outline)
J1  7.62,42.55 0 top
J2  7.62,29.84 0 top
J3  7.62,17.14 0 top
JP1  20.95,22.23 0 bottom
JP2  27.3,20.95 0 bottom
JP3  33.02,32.38 0 bottom
JP4  40.01,-195.58 0 bottom  (outside the outline)
LED1  12.7,-154.94 0 bottom  (outside the outline)
LED2  12.7,-158.12 0 bottom  (outside the outline)
LED3  12.7,-161.29 0 bottom  (outside the outline)
R1  142.88,76.2 180 bottom  (outside the outline)
R2  142.88,73.66 180 bottom  (outside the outline)
R3  142.88,71.12 180 bottom  (outside the outline)
R4  142.88,68.58 180 bottom  (outside the outline)
R5  139.06,85.09 90 bottom  (outside the outline)
R6  139.06,92.71 180 bottom  (outside the outline)
R7  147.96,87.63 180 bottom  (outside the outline)
R8  147.96,85.09 0 bottom  (outside the outline)
R9  147.96,90.17 180 bottom  (outside the outline)
R10  147.96,92.71 0 bottom  (outside the outline)
R11  147.96,72.39 0 bottom  (outside the outline)
R12  147.96,69.85 0 bottom  (outside the outline)
R13  147.96,67.31 0 bottom  (outside the outline)
R14  155.57,87.63 180 bottom  (outside the outline)
R15  153.03,95.25 180 bottom  (outside the outline)
R16  32.38,22.23 270 bottom
R17  43.18,29.84 270 bottom
R18  87.63,74.3 0 bottom
R19  12.7,-170.81 0 bottom  (outside the outline)
R20  12.7,-181.61 0 bottom  (outside the outline)
R21  12.7,-186.06 0 bottom  (outside the outline)
R22  12.7,-195.58 0 bottom  (outside the outline)
R23  12.7,-207.65 0 bottom  (outside the outline)
R24  12.7,-212.09 0 bottom  (outside the outline)
R25  22.23,-142.88 0 bottom  (outside the outline)
R26  22.23,-158.75 0 bottom  (outside the outline)
R27  22.23,-174.62 0 bottom  (outside the outline)
R28  31.75,-136.53 0 bottom  (outside the outline)
R29  31.75,-140.97 0 bottom  (outside the outline)
R30  31.75,-145.41 0 bottom  (outside the outline)
R31  28.57,-151.13 90 bottom  (outside the outline)
R32  30.48,-154.31 0 bottom  (outside the outline)
R33  30.48,-156.84 0 bottom  (outside the outline)
R34  40.64,-166.37 0 bottom  (outside the outline)
R35  40.64,-170.81 0 bottom  (outside the outline)
R36  40.64,-175.26 0 bottom  (outside the outline)
R37  40.64,-179.71 0 bottom  (outside the outline)
R38  40.64,-190.5 0 bottom  (outside the outline)
R39  40.64,-212.72 0 bottom  (outside the outline)
R40  40.64,-223.52 0 bottom  (outside the outline)
R41  53.34,-137.16 0 bottom  (outside the outline)
R42  53.34,-149.22 0 bottom  (outside the outline)
R43  53.34,-125.09 0 bottom  (outside the outline)
R44  53.34,-161.29 0 bottom  (outside the outline)
R45  62.23,-165.74 0 bottom  (outside the outline)
R46  62.23,-170.18 0 bottom  (outside the outline)
R47  62.23,-174.62 0 bottom  (outside the outline)
R48  62.23,-199.39 0 bottom  (outside the outline)
R49  62.23,-203.84 0 bottom  (outside the outline)
R50  62.23,-208.28 0 bottom  (outside the outline)
S1  15.24,4.45 0 top
S2  36.83,4.45 0 top
S3  58.42,4.45 0 top
S4  83.82,5.71 0 top
SJ1  147.96,78.74 0 bottom  (outside the outline)
SJ2  45.72,29.84 270 bottom
SJ3  117.47,59.05 0 bottom  (outside the outline)
SJ4  87,69.85 0 bottom
SW1  81.28,53.98 0 top
SW2  83.82,19.05 0 top
T1  12.7,-200.66 0 bottom  (outside the outline)
U1  136.53,73.66 90 bottom  (outside the outline)
U$1  18.41,69.85 90 top
U$2  131.44,67.31 0 bottom  (outside the outline)
U$3  35.56,91.44 0 top
U$4  35.56,53.98 180 bottom

### Tracks (layer width: path | path; a pad name or v marks a point on that pad's centre or on a via)
3V3  (24 unrouted)
5V  (6 unrouted)
ADC_BTN  (4 unrouted)
ADC_I1  (4 unrouted)
ADC_Q1  (4 unrouted)
ADC_RX_I  (2 unrouted)
ADC_RX_Q  (2 unrouted)
ADC_VIN  (1 unrouted)
EXP_CS  (1 unrouted)
GND  (74 unrouted)
  pour Top: 0,99.95 0,0 99.06,0 99.06,99.95
LCD_CS  (1 unrouted)
LCD_DC  (1 unrouted)
N$1  (2 unrouted)
N$2  (2 unrouted)
N$3  (2 unrouted)
N$4  (2 unrouted)
N$5  (3 unrouted)
N$6  (1 unrouted)
N$7  (3 unrouted)
N$8  (1 unrouted)
N$9  (3 unrouted)
N$10  (3 unrouted)
N$12  (2 unrouted)
N$13  (1 unrouted)
N$14  (3 unrouted)
N$15  (1 unrouted)
N$17  (1 unrouted)
N$18  (1 unrouted)
N$19  (1 unrouted)
N$20  (2 unrouted)
N$21  (2 unrouted)
N$22  (1 unrouted)
N$23  (1 unrouted)
N$24  (2 unrouted)
N$25  (1 unrouted)
N$26  (2 unrouted)
N$27  (2 unrouted)
N$28  (2 unrouted)
N$29  (1 unrouted)
N$30  (2 unrouted)
N$31  (1 unrouted)
N$32  (2 unrouted)
N$33  (2 unrouted)
N$34  (1 unrouted)
N$36  (1 unrouted)
N$37  (1 unrouted)
N$39  (1 unrouted)
N$42  (3 unrouted)
N$43  (3 unrouted)
N$44  (3 unrouted)
N$45  (3 unrouted)
N$46  (2 unrouted)
N$47  (1 unrouted)
N$48  (3 unrouted)
N$49  (3 unrouted)
N$50  (3 unrouted)
N$51  (1 unrouted)
N$52  (2 unrouted)
N$53  (1 unrouted)
N$54  (1 unrouted)
N$55  (1 unrouted)
N$57  (1 unrouted)
N$59  (1 unrouted)
N$61  (1 unrouted)
N$63  (2 unrouted)
N$64  (2 unrouted)
N$65  (3 unrouted)
N$66  (2 unrouted)
N$67  (2 unrouted)
N$69  (2 unrouted)
N$71  (2 unrouted)
N$73  (2 unrouted)
RX_I  (1 unrouted)
RX_Q  (1 unrouted)
RXEN  (3 unrouted)
SCL  (1 unrouted)
SDA  (1 unrouted)
SPI_MOSI  (2 unrouted)
SPI_SCK  (2 unrouted)
TX  (1 unrouted)
TX_I  (2 unrouted)
TX_Q  (2 unrouted)
TXEN  (2 unrouted)
VIN  (3 unrouted)
VOPAMP  (5 unrouted)